# Altium schematic sheet Power_Supply_V1.1.SchDoc
size A4
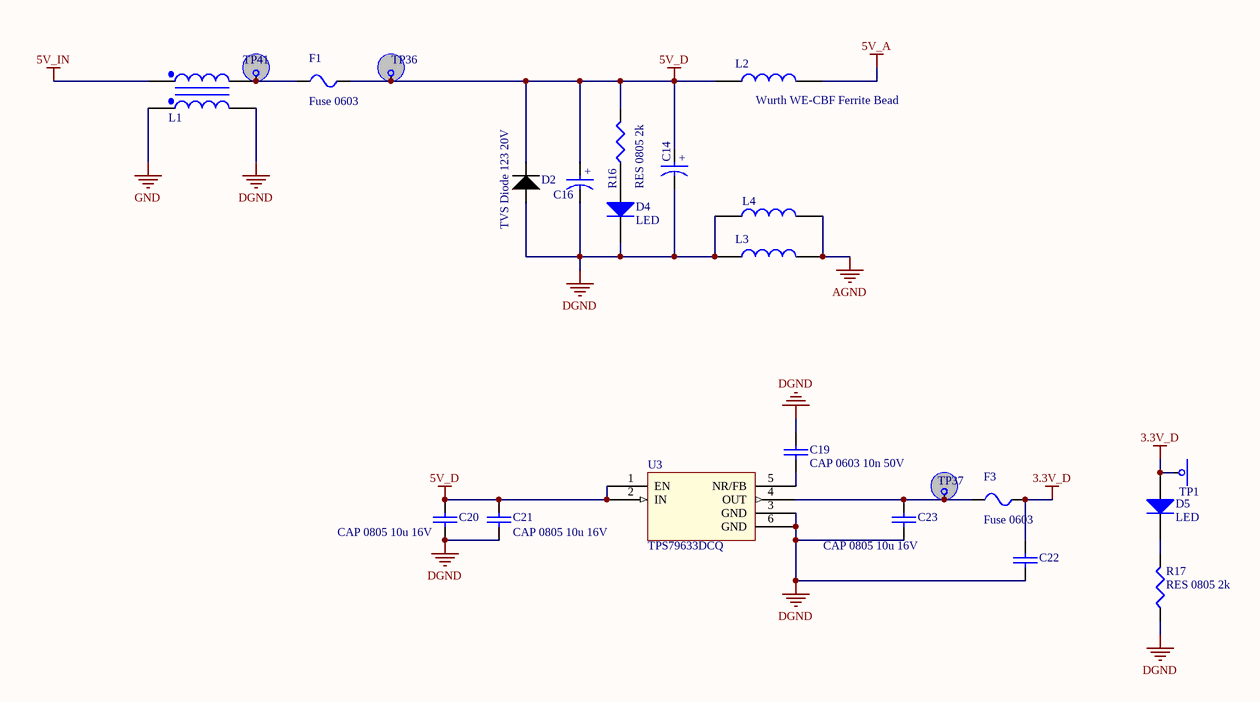
[diagram p0: Power_Supply_V1.1.SchDoc]

## Parts
C14  Panasonic SMD aluminum cap FT V size d  [Panasonic TF V SMD size D cap]  (value not drawn)
C16  Panasonic SMD aluminum cap FT V size d  [Panasonic TF V SMD size D cap]  (value not drawn)
C19  CAP 0603 10n 50V  [CAPC1608N]
C20  CAP 0805 10u 16V  [CAPC2012N]
C21  CAP 0805 10u 16V  [CAPC2012N]
C22  CAP 0805 10u 16V  [CAPC2012N]  (value not drawn)
C23  CAP 0805 10u 16V  [CAPC2012N]
D2  TVS Diode 123 20V  [SOD-123]
D4  LED  [LED1608N]
D5  LED  [LED1608N]
F1  Fuse 0603  [RES1608N]
F3  Fuse 0603  [RES1608N]
L1  Wurth  [WURTH WE-SL5]  (value not drawn)
L2  Wurth WE-CBF Ferrite Bead  [Wurth WE-CBF]  (value not drawn)
L3  Wurth WE-CBF Ferrite Bead  [Wurth WE-CBF]
L4  Wurth WE-CBF Ferrite Bead  [Wurth WE-CBF]  (value not drawn)
R16  RES 0805 2k  [RES2012N]
R17  RES 0805 2k  [RES2012N]
TP1  TEST_POINT_HOOK  [Keystone 5000]  (value not drawn)
TP36  *  [Keystone 5000]  (value not drawn)
TP37  *  [Keystone 5000]  (value not drawn)
TP41  TEST_POINT_HOOK  [Keystone 5000]  (value not drawn)
U3  TPS79633DCQ  [SOT-223-6]

## Nets
3.3V_D: C22.1 D5.1 F3.2 TP1.1
5V_A: L2.2
5V_D: C14.1 C16.1 C20.1 C21.1 D2.1(C) F1.2 L2.1 R16.2 TP36.1 U3.1(EN) U3.2(IN)
5V_IN: L1.1
AGND: L3.2 L4.2
DGND: C14.2 C16.2 C19.1 C20.2 C21.2 C22.2 C23.2 D2.2(A) D4.2 L1.3 L3.1 L4.1 R17.1 U3.3(GND) U3.6(GND)
GND: L1.4
NetC19_2: C19.2 U3.5(NR/FB)
NetC23_1: C23.1 F3.1 TP37.1 U3.4(OUT)
NetD4_1: D4.1 R16.1
NetD5_2: D5.2 R17.2
NetF1_1: F1.1 L1.2 TP41.1

## Notes on the sheet
- (in symbol Panasonic SMD aluminum cap FT V size d) +

## Library data of the parts
C14 C16 = Panasonic SMD aluminum cap FT V size d: Manuf: Panasonic - ECG; Vendor: DIGIKEY; Cost@10: 0.844
C19 = CAP 0603 TBD: Vendor: TBD; Part#: TBD; Manuf: TBD; Manuf#: TBD; Cost: TBD
C20-C23 = CAP 0805 TBD: Vendor: TBD; Part#: TBD; Manuf: TBD; Manuf#: TBD; Cost: TBD
D2 = TVS Diode TBD
D4 D5 = LED: Manuf: OSRAM; Manuf#: LG M67K-G1J2-24-0-2-R18-Z; Part#: 475-1406-1-ND; Vendor: Digikey; Cost@10: 0.17
L1 = Wurth WE-SL5: Wurth WE-SL5 Common Mode Choke; Part Number: 811-1253-ND; Manufacturer Part Number: 51105C; Manufacturer: Murata Power Solutions Inc; Vendor: Digikey; Packaging: Vertical, 4 PC Pin, Through hole
L2-L4 = Wurth WE-CBF: Wurth WE-CBF Ferrite Bead 2A 0.15Ohm; Part Number: 811-1253-ND; Manufacturer Part Number: 51105C; Manufacturer: Murata Power Solutions Inc; Vendor: Digikey; Packaging: Vertical, 4 PC Pin, Through hole
R16 R17 = RES 0805 TBD: Manuf#: TBD; Manuf: TBD; Vendor: TBD; Cost@10: TBD; Part#: TBD
TP36 TP37 = TEST_POINT_HOOK
U3 = TPS79633: Single Output LDO, 1.0A, Fixed(3.3V), Low Noise, High PSRR; Manufacturer_Part_Number: tps79633_dcq_6; Vendor: Texas Instruments; PACKAGE_DESIGNATOR: DCQ; PIN_COUNT: 6; FAMILY_NAME: SINGLE CHANNEL LDO; INDUSTRY_STD_PKG_TYPE: SOT-223; GENERIC_PART_NUMBER: TPS79633; Datasheet URL: http://www.ti.com/lit/gpn/TPS79633; Manufacturer: Texas Instruments; RefDes: RefDes; Type: DEV; Value: Value; Supplier 1: Digi-Key; Supplier 2: Newark